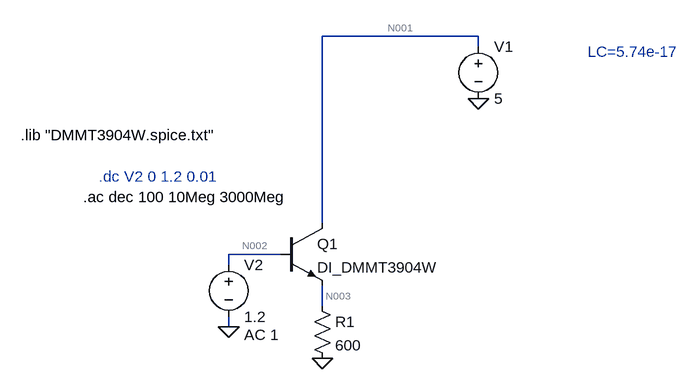
[diagram p0: schematic modelling.asc]
modelling.asc, the LTspice schematic file:
Version 4.1
SHEET 1 880 680
WIRE 432 -192 192 -192
WIRE 432 -176 432 -192
WIRE 192 96 192 -192
WIRE 128 144 48 144
WIRE 48 160 48 144
WIRE 192 224 192 192
WIRE 48 256 48 240
FLAG 432 -96 0
FLAG 48 256 0
FLAG 192 304 0
SYMBOL npn 128 96 R0
SYMATTR InstName Q1
SYMATTR Value DI_DMMT3904W
SYMBOL voltage 432 -192 R0
WINDOW 123 0 0 Left 0
WINDOW 39 0 0 Left 0
SYMATTR InstName V1
SYMATTR Value 5
SYMBOL voltage 48 144 R0
WINDOW 123 24 124 Left 2
WINDOW 39 0 0 Left 0
SYMATTR Value2 AC 1
SYMATTR InstName V2
SYMATTR Value 1.2
SYMBOL res 176 208 R0
SYMATTR InstName R1
SYMATTR Value 600
TEXT -272 -40 Left 2 !.lib "DMMT3904W.spice.txt"
TEXT -152 24 Left 2 ;.dc V2 0 1.2 0.01
TEXT -176 56 Left 2 !.ac dec 100 10Meg 3000Meg
TEXT 600 -168 Left 2 ;LC=5.74e-17

The netlist it stands for:
* modelling.asc
Q1 N001 N002 N003 0 DI_DMMT3904W
V1 N001 0 5
V2 N002 0 1.2 AC 1
R1 N003 0 600
.model NPN NPN
.model PNP PNP
.lib standard.bjt
.lib "DMMT3904W.spice.txt"
* .dc V2 0 1.2 0.01
.ac dec 100 10Meg 3000Meg
* LC=5.74e-17
.backanno
.end

* Results of the author's LTspice run, read from the files saved beside the schematic
* Operating Point, zero values left out:
*   V(n001) = 5 V
*   V(n002) = 1.2 V
*   V(n003) = 563.8 mV
*   I(R1) = 939.7 µA
*   I(V1) = -934.7 µA
*   I(V2) = -4.988 µA
*   Ib(Q1) = 4.988 µA
*   Ic(Q1) = 934.7 µA
*   Ie(Q1) = -939.7 µA
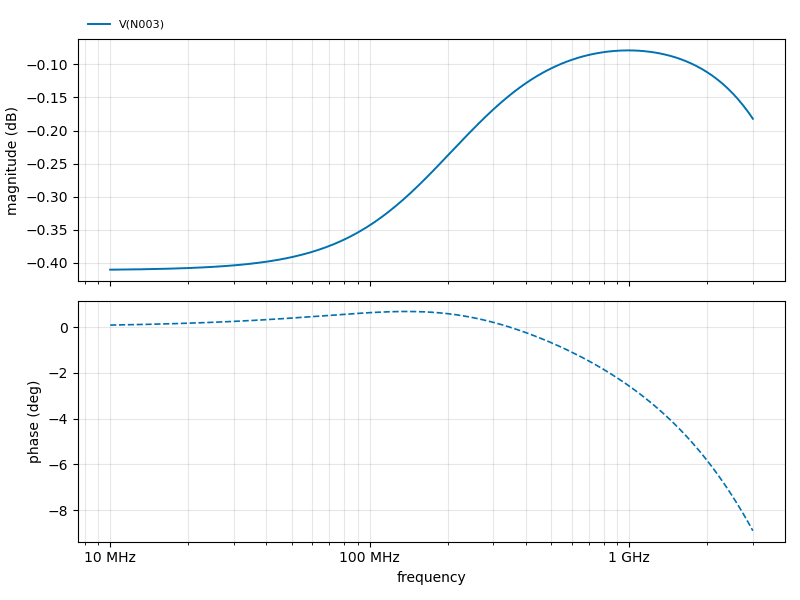
[diagram p1: AC Analysis of modelling.asc, plotted from the saved traces]
* AC Analysis, 1 run:
*   V(N003): -0.41 dB at 10 MHz, -0.18 dB at 3 GHz, peak -0.08 dB at 1 GHz